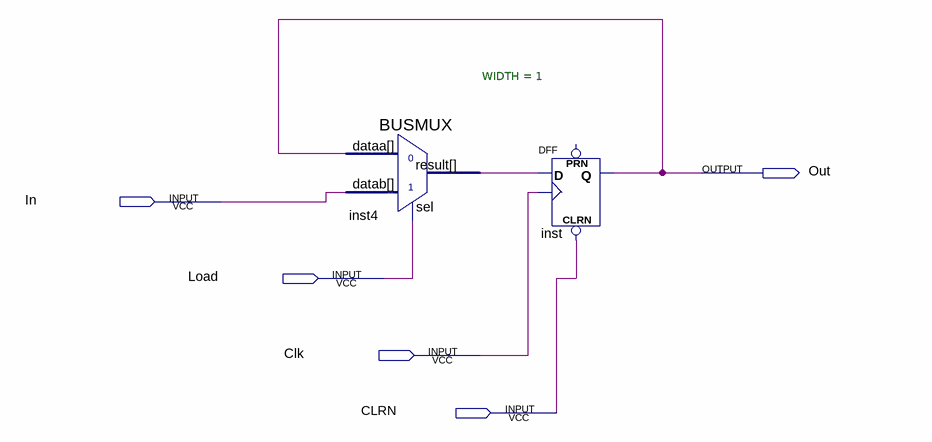
[diagram p0: schematic sheet]
// Quartus schematic register.bdf as structural Verilog: 2 symbols, 5 pins
module register (
  input  In,
  input  Load,
  input  Clk,
  input  CLRN,
  output Out
);

  wire inst4_result;

  BUSMUX #(.WIDTH(1)) inst4 (.datab(In), .sel(Load), .dataa(Out), .result(inst4_result));
  DFF inst (.CLRN(CLRN), .CLK(Clk), .D(inst4_result), .Q(Out));  // open: PRN
endmodule
